# EAGLE design LQFP-QFN-44_Test (EAGLE 6.3)
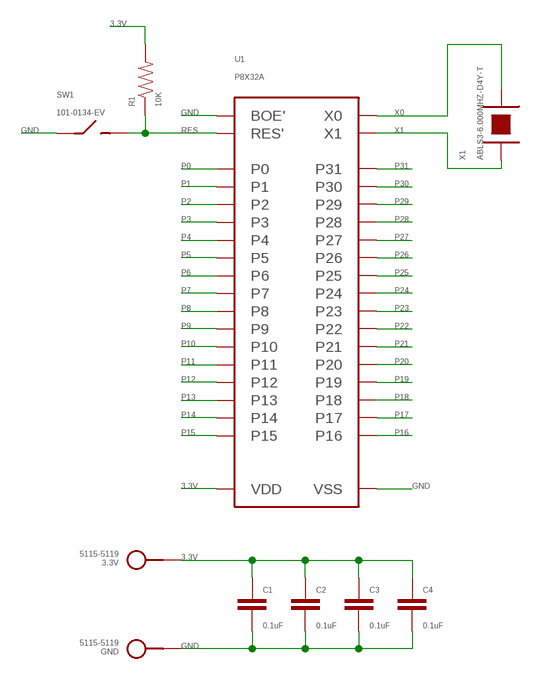
[diagram p0: schematic, sheet 1]

## Parts
3.3V  5115-5119  TEST_POINT_SINGLEKEYSTONE_5115-5119  [KEYSTONE_5115-5119]
C1  0.1uF  CAPACITOR_NON_POLAR0402  [0402]
C2  0.1uF  CAPACITOR_NON_POLAR0402  [0402]
C3  0.1uF  CAPACITOR_NON_POLAR0402  [0402]
C4  0.1uF  CAPACITOR_NON_POLAR0402  [0402]
GND  5115-5119  TEST_POINT_SINGLEKEYSTONE_5115-5119  [KEYSTONE_5115-5119]
R1  10K  RESISTOR0402  [0402]
SW1  101-0134-EV  SPST101-0134-EV  [101-0134-EV]
U1  P8X32A  P8X32A_PROPELLERLQFP/QFN-44  [DUAL_LQFP_QFN_44]
X1  ABLS3-6.000MHZ-D4Y-T  CRYSTALHC-49  [HC-49/US_SM]

## Nets
3.3V: 3.3V.P$1 C1.1 C2.1 C3.1 C4.1 R1.2 U1.8(VDD) U1.18(VDD) U1.30(VDD) U1.40(VDD) U1.52(VDD) U1.62(VDD) U1.74(VDD) U1.84(VDD)
GND: C1.2 C2.2 C3.2 C4.2 GND.P$1 SW1.1(A) U1.5(VSS) U1.6(BOE') U1.17(VSS) U1.27(VSS) U1.39(VSS) U1.49(VSS) U1.50(BOE') U1.61(VSS) U1.71(VSS) U1.83(VSS) U1.PAD(VSS)
P0: U1.41(P0) U1.85(P0)
P1: U1.42(P1) U1.86(P1)
P2: U1.43(P2) U1.87(P2)
P3: U1.44(P3) U1.88(P3)
P4: U1.1(P4) U1.45(P4)
P5: U1.2(P5) U1.46(P5)
P6: U1.3(P6) U1.47(P6)
P7: U1.4(P7) U1.48(P7)
P8: U1.9(P8) U1.53(P8)
P9: U1.10(P9) U1.54(P9)
P10: U1.11(P10) U1.55(P10)
P11: U1.12(P11) U1.56(P11)
P12: U1.13(P12) U1.57(P12)
P13: U1.14(P13) U1.58(P13)
P14: U1.15(P14) U1.59(P14)
P15: U1.16(P15) U1.60(P15)
P16: U1.19(P16) U1.63(P16)
P17: U1.20(P17) U1.64(P17)
P18: U1.21(P18) U1.65(P18)
P19: U1.22(P19) U1.66(P19)
P20: U1.23(P20) U1.67(P20)
P21: U1.24(P21) U1.68(P21)
P22: U1.25(P22) U1.69(P22)
P23: U1.26(P23) U1.70(P23)
P24: U1.31(P24) U1.75(P24)
P25: U1.32(P25) U1.76(P25)
P26: U1.33(P26) U1.77(P26)
P27: U1.34(P27) U1.78(P27)
P28: U1.35(P28) U1.79(P28)
P29: U1.36(P29) U1.80(P29)
P30: U1.37(P30) U1.81(P30)
P31: U1.38(P31) U1.82(P31)
RES: R1.1 SW1.2(B) U1.7(RES') U1.51(RES')
X0: U1.29(X0) U1.73(X0) X1.P$2
X1: U1.28(X1) U1.72(X1) X1.P$1

## Library data of the parts
3.3V GND = PP_Connectors:TEST_POINT_SINGLE
C1-C4 = PP_Passives:CAPACITOR_NON_POLAR: Capacitor Non Polarized
R1 = PP_Passives:RESISTOR: Resistors
SW1 = PP_Electromechanical:SPST: SPST Switches
U1 = PP_DigitalIC:P8X32A_PROPELLER
X1 = PP_FreqCtrl:CRYSTAL

## Board
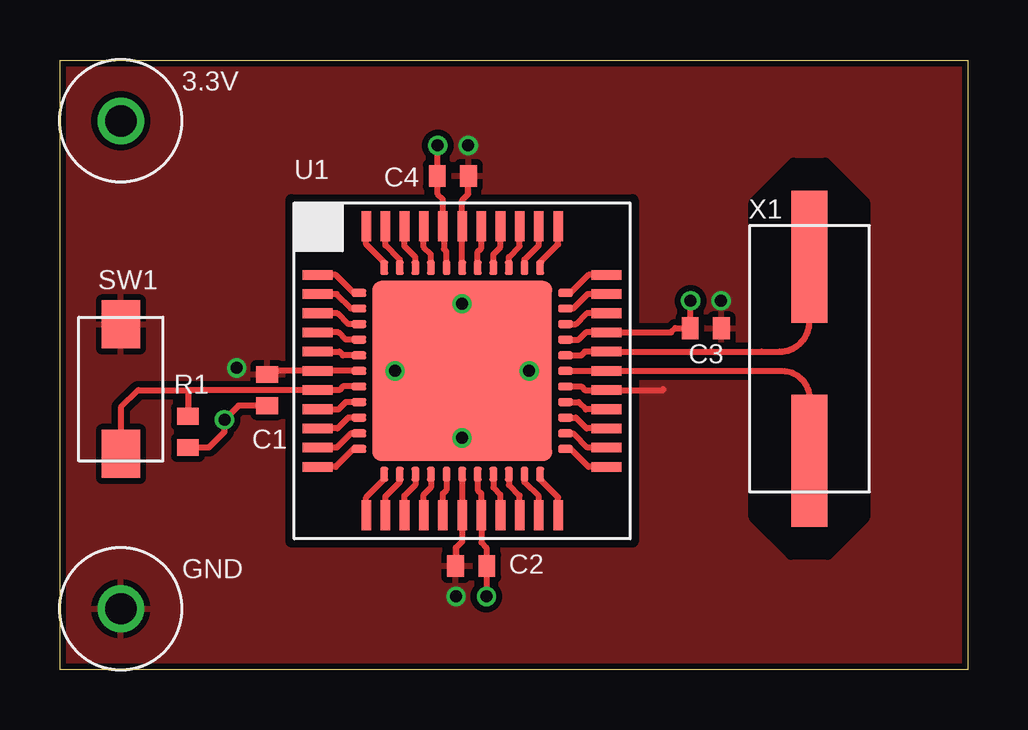
[diagram p1: board, top side]
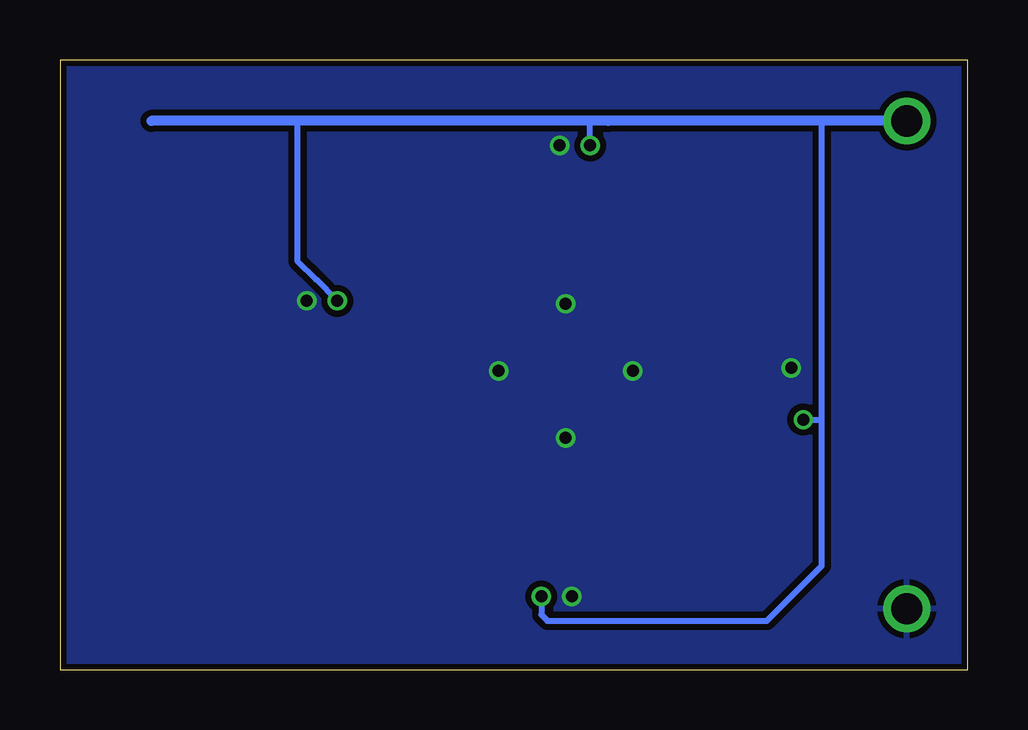
[diagram p2: board, bottom side, seen from below]

Size 37.85 x 25.4 mm. Coordinates in mm from the lower left corner, seen from the top.
Outline: 0,25.4 37.85,25.4 37.85,0 0,0 0,25.4
Copper layers (1*16): Top 0.035mm / dielectric 0.2mm / Bottom 0.035mm
Design rules "Seeed_2_Layer_DRU": minimum track width 6mil, minimum drill 12mil, track to track 6mil, track to pad 6mil, pad to pad 6mil, via to via 6mil, smd to smd 0mil, copper to edge 10mil, drill to drill 10mil, minimum pad ring 6mil, minimum via ring 6mil, stop-mask expansion 2mil, vias tented up to drill 25mil, thermal gap 10mil
tRestrict: area 9.7,5.3 to 23.9,19.6; area 29,4.8 to 33.5,21.1

### Footprints (pad centres in the part's own frame; a part is rotated, then mirrored left to right if it is on the bottom)
KEYSTONE_5115-5119 = drill 1.3: P$1 0,0
0402 = smd 0.7 x 0.9: 1 -0.65,0; 2 0.65,0
101-0134-EV = smd 2 x 1.6: 1 -2.7,0; 2 2.7,0
DUAL_LQFP_QFN_44 = smd 1.25 x 0.4: 1 -6.025,4; 2 -6.025,3.2; 3 -6.025,2.4; 4 -6.025,1.6; 5 -6.025,0.8; 6 -6.025,0; 7 -6.025,-0.8; 8 -6.025,-1.6; 9 -6.025,-2.4; 10 -6.025,-3.2; 11 -6.025,-4; 23 6.025,-4; 24 6.025,-3.2; 25 6.025,-2.4; 26 6.025,-1.6; 27 6.025,-0.8; 28 6.025,0; 29 6.025,0.8; 30 6.025,1.6; 31 6.025,2.4; 32 6.025,3.2; 33 6.025,4 | smd 0.4 x 1.25: 12 -4,-6.025; 13 -3.2,-6.025; 14 -2.4,-6.025; 15 -1.6,-6.025; 16 -0.8,-6.025; 17 0,-6.025; 18 0.8,-6.025; 19 1.6,-6.025; 20 2.4,-6.025; 21 3.2,-6.025; 22 4,-6.025; 34 4,6.025; 35 3.2,6.025; 36 2.4,6.025; 37 1.6,6.025; 38 0.8,6.025; 39 0,6.025; 40 -0.8,6.025; 41 -1.6,6.025; 42 -2.4,6.025; 43 -3.2,6.025; 44 -4,6.025 | smd 0.6 x 0.33: 45 -4.3,3.25; 46 -4.3,2.6; 47 -4.3,1.95; 48 -4.3,1.3; 49 -4.3,0.65; 50 -4.3,0; 51 -4.3,-0.65; 52 -4.3,-1.3; 53 -4.3,-1.95; 54 -4.3,-2.6; 55 -4.3,-3.25; 67 4.3,-3.25; 68 4.3,-2.6; 69 4.3,-1.95; 70 4.3,-1.3; 71 4.3,-0.65; 72 4.3,0; 73 4.3,0.65; 74 4.3,1.3; 75 4.3,1.95; 76 4.3,2.6; 77 4.3,3.25 | smd 0.33 x 0.6: 56 -3.25,-4.3; 57 -2.6,-4.3; 58 -1.95,-4.3; 59 -1.3,-4.3; 60 -0.65,-4.3; 61 0,-4.3; 62 0.65,-4.3; 63 1.3,-4.3; 64 1.95,-4.3; 65 2.6,-4.3; 66 3.25,-4.3; 78 3.25,4.3; 79 2.6,4.3; 80 1.95,4.3; 81 1.3,4.3; 82 0.65,4.3; 83 0,4.3; 84 -0.65,4.3; 85 -1.3,4.3; 86 -1.95,4.3; 87 -2.6,4.3; 88 -3.25,4.3 | smd 7.5 x 7.5: PAD 0,0
HC-49/US_SM = smd 5.5 x 1.5: P$1 -4.25,0; P$2 4.25,0

### Placement (x,y rotation side)
3.3V  2.54,22.86 0 top
C1  8.64,11.65 90 top
C2  17.14,4.32 180 top
C3  26.92,14.22 0 top
C4  16.38,20.57 0 top
GND  2.54,2.54 0 top
R1  5.33,9.91 270 top
SW1  2.54,11.68 270 top
U1  16.76,12.45 0 top
X1  31.24,12.95 90 top

### Tracks (layer width: path | path; a pad name or v marks a point on that pad's centre or on a via)
3.3V  (via drill 0.5)
  Top 0.254: U1.52 11.91,11.15 11.61,10.85 U1.8 | U1.84 16.11,17.41 16,17.53 16,18.43 U1.40 15.96,19.34 15.96,19.6 15.75,19.81 15.75,20.57 | U1.62 17.41,7.48 17.56,7.33 U1.18 17.56,5.3 17.78,5.08 17.78,4.33 C2.1 | U1.74 21.62,13.75 21.92,14.05 U1.30 25.48,14.05 25.65,14.22 26.16,14.22 | C4.1 15.75,20.56 15.75,20.57 | 26.15,14.35 C3.1 26.16,14.22 | C1.1 7.44,11 v6.86,10.41 6.86,9.9 6.21,9.26 R1.2 | 15.75,20.57 v15.75,21.84 | C2.1 v17.78,3.05 | 26.16,14.22 26.29,14.35 26.29,15.24 v26.29,15.37
  Bottom 0.254: v6.86,10.41 6.1,10.41 6.1,10.92 | 6.1,10.92 6.1,22.86 | 14.99,22.86 15.75,22.86 v15.75,21.84 | v26.29,15.37 27.18,16.26 27.94,17.02 27.94,22.86 | v17.78,3.05 17.78,2.29 17.53,2.03 8.38,2.03 6.1,4.32 6.1,10.92
  Bottom 0.406: 3.3V.P$1 6.1,22.86 14.99,22.86 15.75,22.86 27.94,22.86 34.04,22.86
GND  (via drill 0.5)
  Top 0.254: U1.49 11.8,13.1 11.65,13.25 U1.5 | U1.71 21.73,11.8 21.88,11.65 22.86,11.65 22.86,11.68 | U1.6 U1.50 8.78,12.45 C1.2 | U1.61 16.76,6.35 16.76,5.33 16.51,5.08 16.51,4.33 C2.2 | U1.83 16.76,18.54 16.76,19.56 17.02,19.81 17.02,20.57 | U1.27 25.15,11.65 25.15,11.68
  other vias: 16.76,15.24 16.76,9.65 19.56,12.45 13.97,12.45 27.56,15.37 7.37,12.57 17.02,21.84 16.51,3.05
  pour Top (isolate 0.254, rank 6): 0,0 37.85,0 37.85,25.4 0,25.4
  pour Bottom (isolate 0.254, rank 6): 0,0 37.85,0 37.85,25.4 0,25.4
P0
  Top 0.254: U1.85 15.46,17.3 15.16,17.6 U1.41
P1
  Top 0.254: U1.86 14.81,17.19 14.36,17.64 U1.42
P2
  Top 0.254: U1.87 14.16,17.08 13.56,17.68 U1.43
P3
  Top 0.254: U1.88 13.51,16.97 12.76,17.72 U1.44
P4
  Top 0.254: U1.45 12.24,15.7 11.49,16.45 U1.1
P5
  Top 0.254: U1.46 12.13,15.05 11.53,15.65 U1.2
P6
  Top 0.254: U1.47 12.02,14.4 11.57,14.85 U1.3
P7
  Top 0.254: U1.48 11.91,13.75 11.61,14.05 U1.4
P8
  Top 0.254: U1.53 12.02,10.5 11.57,10.05 U1.9
P9
  Top 0.254: U1.54 12.13,9.85 11.53,9.25 U1.10
P10
  Top 0.254: U1.55 12.24,9.2 11.49,8.45 U1.11
P11
  Top 0.254: U1.56 13.51,7.93 12.76,7.18 U1.12
P12
  Top 0.254: U1.57 14.16,7.81 13.56,7.21 U1.13
P13
  Top 0.254: U1.58 14.81,7.7 14.36,7.25 U1.14
P14
  Top 0.254: U1.59 15.46,7.59 15.16,7.29 U1.15
P15
  Top 0.254: U1.60 16.11,7.48 15.96,7.33 U1.16
P16
  Top 0.254: U1.63 18.06,7.59 18.36,7.29 U1.19
P17
  Top 0.254: U1.64 18.71,7.7 19.16,7.25 U1.20
P18
  Top 0.254: U1.65 19.36,7.81 19.96,7.21 U1.21
P19
  Top 0.254: U1.66 20.01,7.93 20.76,7.18 U1.22
P20
  Top 0.254: U1.67 21.28,9.2 22.03,8.45 U1.23
P21
  Top 0.254: U1.68 21.4,9.85 22,9.25 U1.24
P22
  Top 0.254: U1.69 21.51,10.5 21.96,10.05 U1.25
P23
  Top 0.254: U1.70 21.62,11.15 21.92,10.85 U1.26
P24
  Top 0.254: U1.75 21.51,14.4 21.96,14.85 U1.31
P25
  Top 0.254: U1.76 21.4,15.05 22,15.65 U1.32
P26
  Top 0.254: U1.77 21.28,15.7 22.03,16.45 U1.33
P27
  Top 0.254: U1.78 20.01,16.97 20.76,17.72 U1.34
P28
  Top 0.254: U1.79 19.36,17.08 19.96,17.68 U1.35
P29
  Top 0.254: U1.80 18.71,17.19 19.16,17.64 U1.36
P30
  Top 0.254: U1.81 18.06,17.3 18.36,17.6 U1.37
P31
  Top 0.254: U1.82 17.41,17.41 17.56,17.56 U1.38
RES
  Top 0.254: U1.51 11.8,11.8 11.65,11.65 U1.7 9.69,11.65 5.33,11.65 | SW1.2 2.54,10.92 3.26,11.65 5.33,11.65 | 5.33,11.65 R1.1
X0
  Top 0.254: U1.73 21.73,13.1 21.88,13.25 U1.29 29.25,13.25 29.99,13.25 arc90 31.24,14.49 X1.P$2
X1
  Top 0.254: U1.72 U1.28 30.11,12.45 arc-90 31.24,11.31 X1.P$1